# Altium project Photovoltaic Drive.PrjPcb (part 1 of 2)
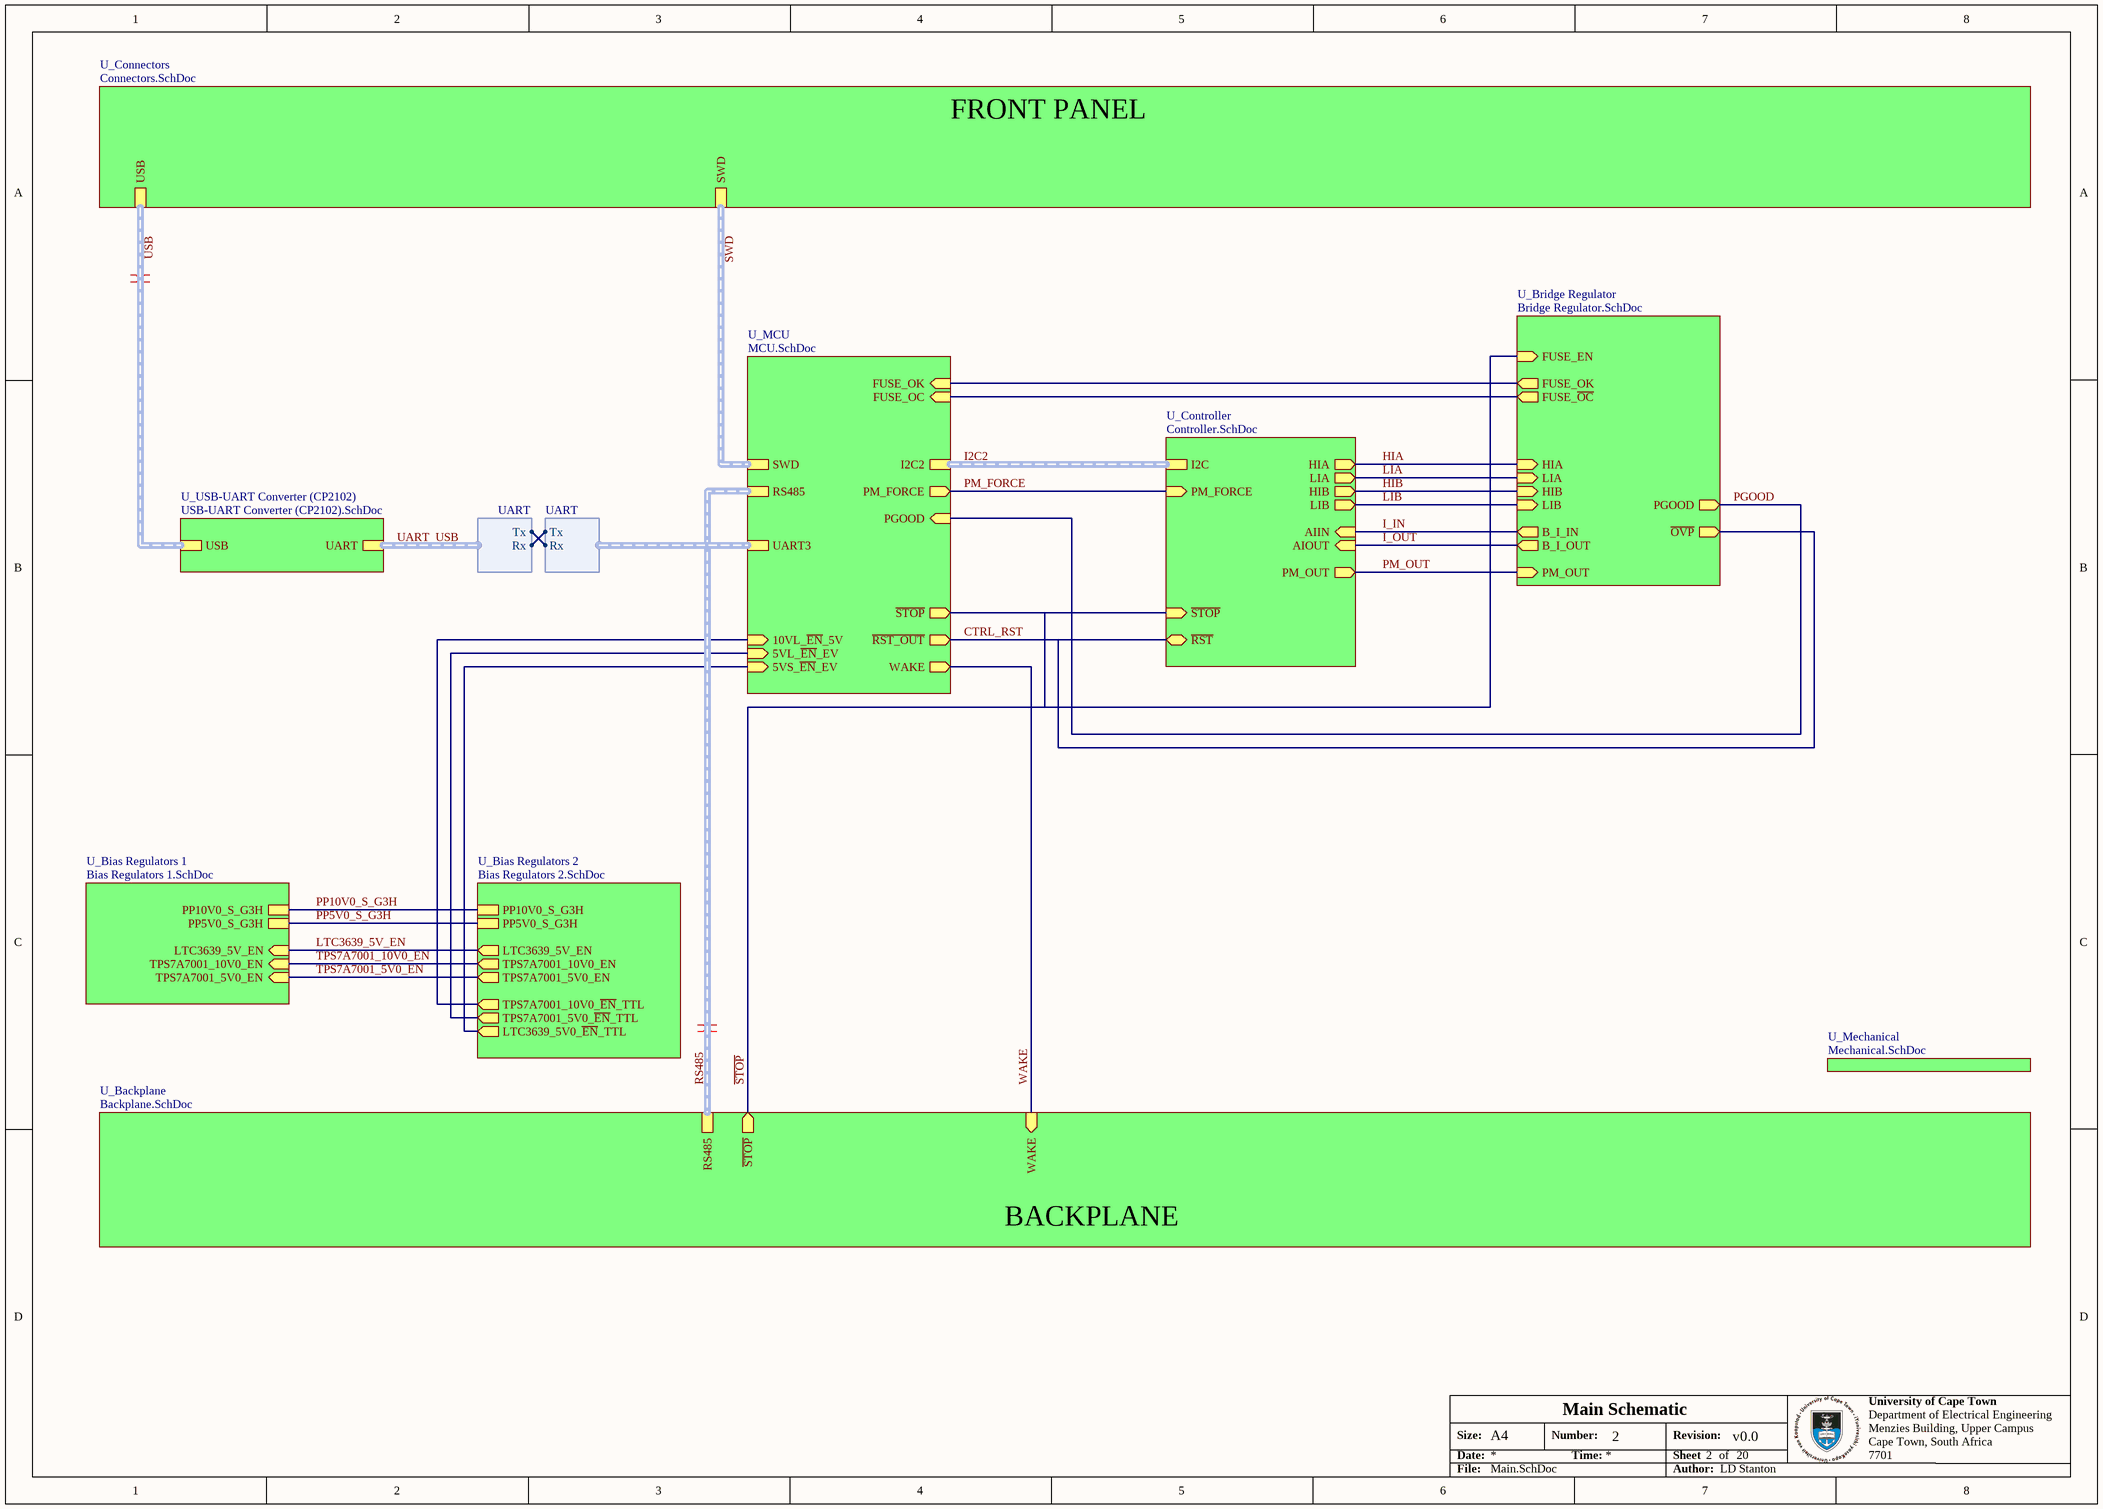
[diagram p0: Main.SchDoc]
Approv_Date_Chk: --/--/----; Approv_Date_Eng: --/--/----; ASM_DOC: Assembley.PCBDwf; BOM_DOC: Bill of Materials.csv; Checker: [UNCHECKED]; CPL_DOC: Pick & Place.csv; DwgTitleLine1: - - - - -; DwgTitleLine2: - - - - -; FAB_DOC: Fabrication.PCBDwf; PCB_DOC: PCB.PcbDoc; Project_Revision: v0.0; Rev_Date_1: --/--/----; Rev_Date_2: --/--/----; Rev_Date_3: --/--/----; Rev_Date_4: --/--/----; Rev_Desc_1: - - - - -; Rev_Desc_2: - - - - -; Rev_Desc_3: - - - - -; Rev_Desc_4: - - - - -; Rev_No_1: -; Rev_No_2: -; Rev_No_3: -; Rev_No_4: -; SCH_DOC: Main.SchDoc
5 sheets, 146 parts. Net scope: hierarchical (ports join the sheet entries above them; power ports are global).
Board file: PCB.PcbDoc
Sheets:
  Main.SchDoc
    U_Connectors = Connectors.SchDoc
    U_Controller = Controller.SchDoc
  System Regulators.SchDoc
  Bridge.SchDoc

## Sheet Main.SchDoc: Main Schematic
size A3; ApprovedBy: LD Stanton; CheckedBy: None; Author: LD Stanton; DrawnBy: LD Stanton; Engineer: LD Stanton; Organization: University of Cape Town; Address1: Department of Electrical Engineering; Address2: Menzies Building, Upper Campus; Address3: Cape Town, South Africa; Address4: 7701; DocumentNumber: 2; Revision: v1.0; SheetNumber: 2; SheetTotal: 20; Project_Name: Photovoltaic Controller

### Sub-sheets
U_Backplane = Backplane.SchDoc (file not in this document): RS485 (harness RS485), ~{STOP} (out), WAKE (in)
U_Bias Regulators 1 = Bias Regulators 1.SchDoc (file not in this document): PP10V0_S_G3H, TPS7A7001_5V0_EN (in), LTC3639_5V_EN (in), TPS7A7001_10V0_EN (in), PP5V0_S_G3H
U_Bias Regulators 2 = Bias Regulators 2.SchDoc (file not in this document): PP5V0_S_G3H, PP10V0_S_G3H, LTC3639_5V_EN (out), TPS7A7001_10V0_EN (out), TPS7A7001_5V0_EN (out), TPS7A7001_10V0_~{EN}_TTL (out), LTC3639_5V0_~{EN}_TTL (out), TPS7A7001_5V0_~{EN}_TTL (out)
U_Bridge Regulator = Bridge Regulator.SchDoc (file not in this document): LIA (in), HIA (in), HIB (in), LIB (in), B_I_IN (out), B_I_OUT (out), PGOOD (out), ~{OVP} (out), PM_OUT (in), FUSE_EN (in), FUSE_OK (out), FUSE_~{OC} (out)
U_Connectors = Connectors.SchDoc: USB (harness USB), SWD (harness SWD)
U_Controller = Controller.SchDoc: LIB (out), HIA (out), I2C (harness I2C), PM_OUT (out), AIIN (in), AIOUT (in), ~{RST} (bidir), HIB (out), LIA (out), PM_FORCE (in), ~{STOP} (in)
U_MCU = MCU.SchDoc (file not in this document): SWD (harness SWD), UART3 (harness UART), ~{RST_OUT} (out), PM_FORCE (out), WAKE (out), RS485 (harness RS485), I2C2 (harness I2C), FUSE_OK (in), ~{STOP} (out), FUSE_OC (in), PGOOD (in), 5VS_~{EN}_EV (in), 10VL_~{EN}_5V (in), 5VL_~{EN}_EV (in)
U_Mechanical = Mechanical.SchDoc (file not in this document): no entries
U_USB-UART Converter (CP2102) = USB-UART Converter (CP2102).SchDoc (file not in this document): USB (harness USB), UART (harness UART)

### Harnesses
UART: Rx, Tx

### Nets
~{STOP}: sheet U_MCU/~{STOP}, sheet U_Controller/~{STOP}, sheet U_Bridge Regulator/FUSE_EN, sheet U_Backplane/~{STOP}
CTRL_RST: sheet U_MCU/~{RST_OUT}, sheet U_Controller/~{RST}, sheet U_Bridge Regulator/~{OVP}  [project net ~{CTRL_RST}]
HIA: sheet U_Controller/HIA, sheet U_Bridge Regulator/HIA
HIB: sheet U_Controller/HIB, sheet U_Bridge Regulator/HIB
I_IN: sheet U_Controller/AIIN, sheet U_Bridge Regulator/B_I_IN
I_OUT: sheet U_Controller/AIOUT, sheet U_Bridge Regulator/B_I_OUT
LIA: sheet U_Controller/LIA, sheet U_Bridge Regulator/LIA
LIB: sheet U_Controller/LIB, sheet U_Bridge Regulator/LIB
LTC3639_5V_EN: sheet U_Bias Regulators 1/LTC3639_5V_EN, sheet U_Bias Regulators 2/LTC3639_5V_EN
PGOOD: sheet U_MCU/PGOOD, sheet U_Bridge Regulator/PGOOD
PM_FORCE: sheet U_MCU/PM_FORCE, sheet U_Controller/PM_FORCE
PM_OUT: sheet U_Controller/PM_OUT, sheet U_Bridge Regulator/PM_OUT
PP5V0_S_G3H: sheet U_Bias Regulators 1/PP5V0_S_G3H, sheet U_Bias Regulators 2/PP5V0_S_G3H
PP10V0_S_G3H: sheet U_Bias Regulators 1/PP10V0_S_G3H, sheet U_Bias Regulators 2/PP10V0_S_G3H
TPS7A7001_5V0_EN: sheet U_Bias Regulators 1/TPS7A7001_5V0_EN, sheet U_Bias Regulators 2/TPS7A7001_5V0_EN
TPS7A7001_10V0_EN: sheet U_Bias Regulators 1/TPS7A7001_10V0_EN, sheet U_Bias Regulators 2/TPS7A7001_10V0_EN
UART_USB.Rx: sheet U_USB-UART Converter (CP2102)/UART.Rx, sheet U_MCU/UART3.Tx
UART_USB.Tx: sheet U_USB-UART Converter (CP2102)/UART.Tx, sheet U_MCU/UART3.Rx
WAKE: sheet U_MCU/WAKE, sheet U_Backplane/WAKE
(unnamed): sheet U_MCU/FUSE_OK, sheet U_Bridge Regulator/FUSE_OK
(unnamed): sheet U_MCU/FUSE_OC, sheet U_Bridge Regulator/FUSE_~{OC}
(unnamed): sheet U_MCU/5VS_~{EN}_EV, sheet U_Bias Regulators 2/LTC3639_5V0_~{EN}_TTL
(unnamed): sheet U_MCU/10VL_~{EN}_5V, sheet U_Bias Regulators 2/TPS7A7001_10V0_~{EN}_TTL
(unnamed): sheet U_MCU/5VL_~{EN}_EV, sheet U_Bias Regulators 2/TPS7A7001_5V0_~{EN}_TTL

### Buses and harness runs
harness I2C2 = sheet U_Controller/I2C = sheet U_MCU/I2C2
harness RS485 = sheet U_Backplane/RS485 = sheet U_MCU/RS485
harness SWD = sheet U_Connectors/SWD = sheet U_MCU/SWD
harness UART_USB = sheet U_USB-UART Converter (CP2102)/UART
harness USB = sheet U_Connectors/USB = sheet U_USB-UART Converter (CP2102)/USB

### Layout directives
differential pair: (no net found under the mark)

### Notes on the sheet
- FRONT PANEL
- BACKPLANE
- Size:
- Date:
- A4
- Number:
- Time:
- Revision:
- Sheet
- of
- File:
- Author:

## Sheet Connectors.SchDoc: Connectors
size A4; ApprovedBy: LD Stanton; CheckedBy: None; Author: LD Stanton; CompanyName: University of Cape Town; DrawnBy: Lawrence Stanton; Engineer: Lawrence Stanton; Organization: University of Cape Town; Address1: Department of Electrical Engineering; Address2: Rondebosch; Address3: Cape Town; Address4: South Africa 7701; DocumentNumber: 3; SheetNumber: 3; SheetTotal: 20; Approv_Date_Eng: --/--/----; Approv_Date_Chk: --/--/----; PCB_Doc: TBD; ASM_Doc: TBD; FAB_Doc: TBD; CML_Doc: TBD; BOM_Doc: TBD
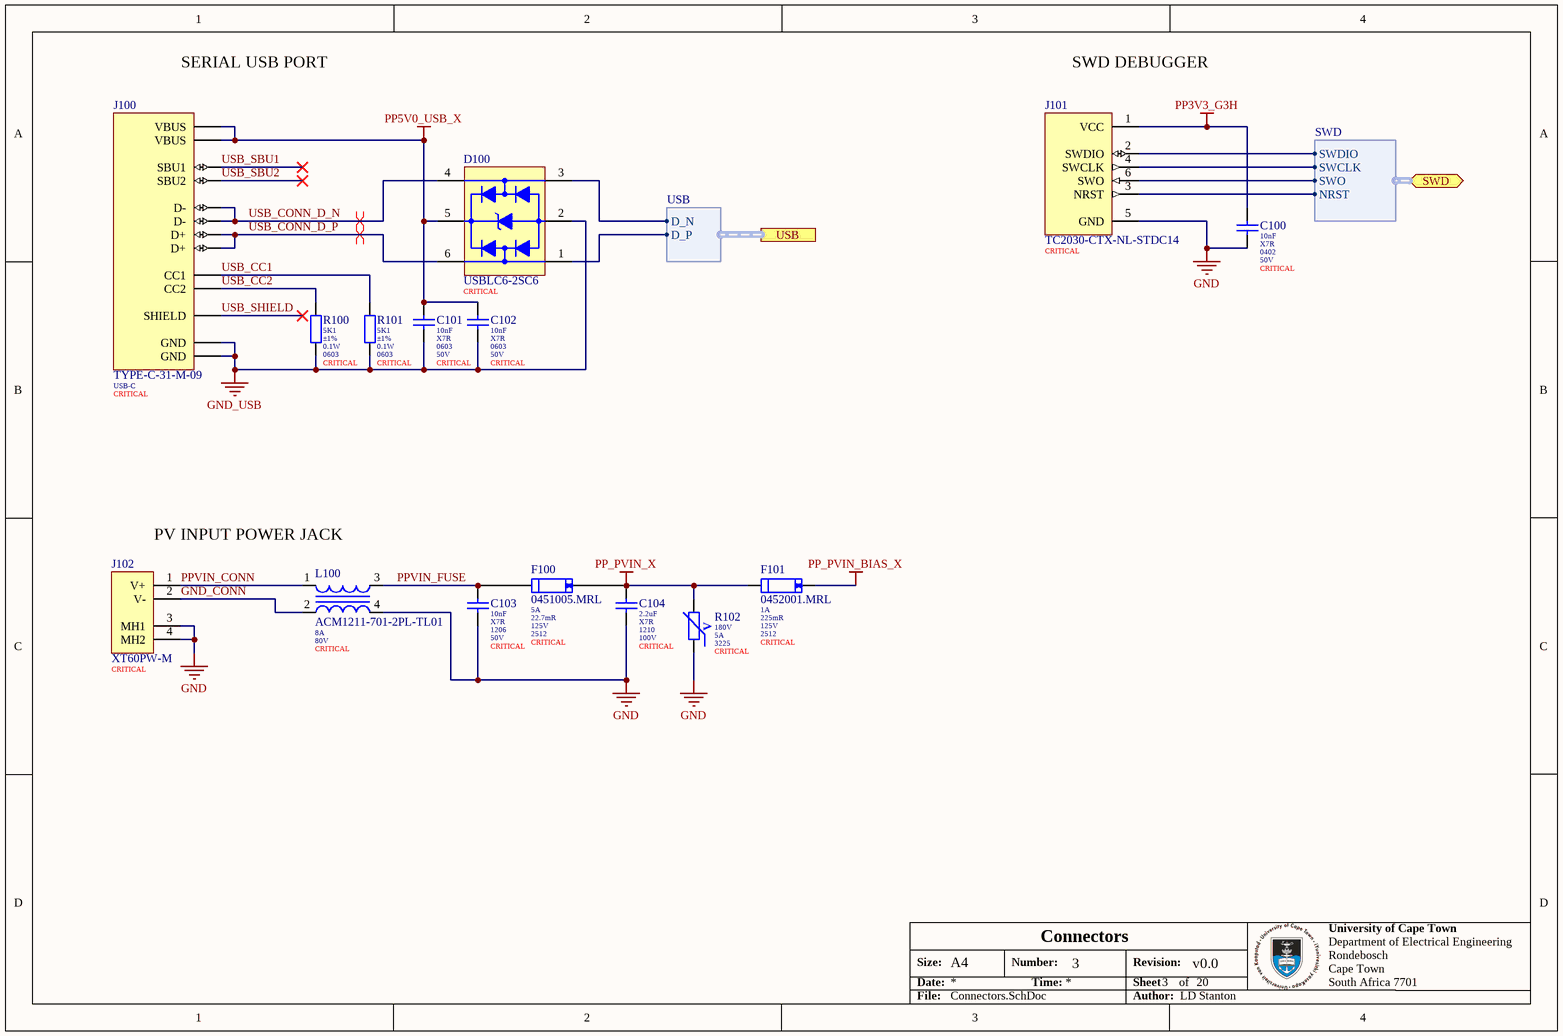
[diagram p1: Connectors.SchDoc]

### Parts
C100  value 10nF  Dielectric: X7R  Package: 0402  Voltage: 50V  Populate: CRITICAL  [0402_050_5 (Samsumg) B]  (hidden comment: CL05B103KB5NNNC)
C101  value 10nF  Dielectric: X7R  Package: 0603  Voltage: 50V  Populate: CRITICAL  [0603_080 (Guandong) B]  (hidden comment: 0603B103K500NT)
C102  value 10nF  Dielectric: X7R  Package: 0603  Voltage: 50V  Populate: CRITICAL  [0603_080 (Guandong) B]  (hidden comment: 0603B103K500NT)
C103  value 10nF  Dielectric: X7R  Package: 1206  Voltage: 50V  Populate: CRITICAL  [1206_125 (Guandong) B]  (hidden comment: 1206B103K500NT)
C104  value 2.2uF  Dielectric: X7R  Package: 1210  Voltage: 100V  Populate: CRITICAL  [1212_250_J (Samsumg) B]  (hidden comment: CL32B225KCJSNNE)
D100  USBLC6-2SC6  Placement: CRITICAL  [SOT-23-6 (USBLC6-2SC6 ST) B]
F100  0451005.MRL  Current: 5A  Resistance: 22.7mR  Voltage: 125V  Package: 2512  Placement: CRITICAL  [Littlefuse 45x B]
F101  0452001.MRL  Current: 1A  Resistance: 225mR  Voltage: 125V  Package: 2512  Placement: CRITICAL  [Littlefuse 45x B]
J100  TYPE-C-31-M-09  Type: USB-C  Placement: CRITICAL  [TYPE-C-31-M-09_OVH]
J101  TC2030-CTX-NL-STDC14  Placement: CRITICAL  [TC2030 NL]  (no BOM)
J102  XT60PW-M  Placement: CRITICAL  [XT60-PW_OVH]
L100  ACM1211-701-2PL-TL01  Current: 8A  Voltage: 80V  Placement: CRITICAL  [ACM1211]
R100  value 5K1  Tolerance: ±1%  Power: 0.1W  Package: 0603  Populate: CRITICAL  [0603 (Uniroyal) B]  (hidden comment: 0603WAF5101T5E)
R101  value 5K1  Tolerance: ±1%  Power: 0.1W  Package: 0603  Populate: CRITICAL  [0603 (Uniroyal) B]  (hidden comment: 0603WAF5101T5E)
R102  Varistor Voltage: 180V  Clamping Current: 5A  Package: 3225  Placement: CRITICAL  [3225 (B726) B]  (hidden comment: B72650M0111K072)

### Ports
SWD (bidir, harness SWD), USB (harness USB)

### Harnesses
USB: D_P, D_N
SWD: SWCLK, SWDIO, NRST, SWO

### Nets
GND: C100.2 C103.2 C104.2 J101.5(GND) J102.3(MH1) J102.4(MH2) L100.4 R102.1
GND_USB: C101.2 C102.2 D100.2(GND) J100.A1B12(GND) J100.B1A12(GND) R100.2 R101.2
PP3V3_G3H: C100.1 J101.1(VCC)
PP5V0_USB_X: C101.1 C102.1 D100.5(VBUS) J100.A4B9(VBUS) J100.B4A9(VBUS)
PP_PVIN_BIAS_X: F101.2
PP_PVIN_X: C104.1 F100.2 F101.1 R102.2
GND_CONN: J102.2(V-) L100.2
PPVIN_CONN: J102.1(V+) L100.1
PPVIN_FUSE: C103.1 F100.1 L100.3
SWD.NRST: J101.3(NRST) ; port SWD.NRST
SWD.SWCLK: J101.4(SWCLK) ; port SWD.SWCLK
SWD.SWDIO: J101.2(SWDIO) ; port SWD.SWDIO
SWD.SWO: J101.6(SWO) ; port SWD.SWO
USB.D_N: D100.3(I/O_2) ; port USB.D_N
USB.D_P: D100.1(I/O_1) ; port USB.D_P
USB_CC1: J100.A5(CC1) R101.1
USB_CC2: J100.B5(CC2) R100.1
USB_CONN_D_N: D100.4(I/O_3) J100.A7(D-) J100.B7(D-)
USB_CONN_D_P: D100.6(I/O_4) J100.A6(D+) J100.B6(D+)
USB_SBU1: J100.A8(SBU1)
USB_SBU2: J100.B8(SBU2)
USB_SHIELD: J100.1(SHIELD)

### Layout directives
differential pair: USB_CONN_D_N, USB_CONN_D_P

### Notes on the sheet
- SERIAL USB PORT
- SWD DEBUGGER
- PV INPUT POWER JACK
- Size:
- Date:
- A4
- Number:
- Time:
- Revision:
- Sheet
- of
- File:
- Author:
- (in symbol CMP-000045-3) V

### Library data of the parts
C100 = CMP-045-000005-9: MLCC 10nF 0402 50V X7R ±10%; Manufacturer: Samsung; ComponentLink1URL: https://datasheet.lcsc.com/szlcsc/Samsung-Electro-Mechanics-CL05C100JB5NNNC_C32949.pdf; Tolerance: ±10%; LCSC Part Number: C15195; ComponentLink1Description: Datasheet
C101 C102 = CMP-014-000000-11: MLCC 10nF 0603 50V X7R ±10%; Manufacturer: Guandong; Tolerance: ±15%; ComponentLink1Description: Datasheet; LCSC Part Number: C57112; ComponentLink1URL: https://datasheet.lcsc.com/szlcsc/Guangdong-Fenghua-Advanced-Tech-0402B102K500NT_C1523.pdf
C103 = CMP-014-000019-1: MLCC 10nF 1206 50V X7R ±10%; Manufacturer: Guandong; ComponentLink1URL: https://datasheet.lcsc.com/szlcsc/Guangdong-Fenghua-Advanced-Tech-0402B102K500NT_C1523.pdf; Tolerance: ±10%; LCSC Part Number: C1846; ComponentLink1Description: Datasheet
C104 = CMP-014-000010-1: MLCC 2.2uF 1210 100V X7R ±10%; Manufacturer: Samsung; LCSC Part Number: C55151; Tolerance: ±10%; ComponentLink1URL: https://datasheet.lcsc.com/szlcsc/Samsung-Electro-Mechanics-CL05C100JB5NNNC_C32949.pdf; ComponentLink1Description: Datasheet
D100 = CMP-004-00000-1: TVS Diode Array Low Capacitance SOT23-6; Manufacturer: Tech Public; Peak Pulse Current: 5A; Breakdown Voltage: 6V; Leakage Current: 150nA; Capacitance: 3.5pF; Data Rate: 480Mbps; Clamping Voltage: 17V; Max Operating Temperature: 125°C; Case/Package: SOT-23-6; ComponentLink1URL: https://datasheet.lcsc.com/lcsc/2108132230_TECH-PUBLIC-USBLC6-2SC6_C2827654.pdf; ComponentLink1Description: Datasheet; Min Operating Temperature: -40°C; RoHS Compliant: Yes; LCSC Part Number: C2827654
F100 = CMP-005-00002-1: Fuse 5A 125VAC/VDCSMD Littlefuse; Body Material: Ceramic; LCSC Part Number: C48467; Max Operating Temperature: 125°C; ComponentLink1Description: Datasheet; ComponentLink1URL: https://datasheet.lcsc.com/lcsc/1809291113_Littelfuse-0451010.MRL_C44479.pdf; Min Operating Temperature: -55°C; RoHS Compliant: Yes
F101 = CMP-005-00001-1: Fuse 1A 125VAC/VDC SMD Littlefuse; Body Material: Ceramic; RoHS Compliant: Yes; Max Operating Temperature: 125°C; Min Operating Temperature: -55°C; ComponentLink1URL: https://datasheet.lcsc.com/lcsc/1809191823_Littelfuse-0452001.MRL_C44669.pdf; LCSC Part Number: C44669; ComponentLink1Description: Datasheet
J100 = CMP-016-000003-6: USB Type C Jack USB2.0 SMD/TH; LCSC Part Number: C2689967; ComponentLink1URL: https://datasheet.lcsc.com/lcsc/2103221609_Korean-Hroparts-Elec-TYPE-C-31-M-09_C2689967.pdf; ComponentLink1Description: Drawing
J101 = CMP-000037-4: 6-Pin Plug-of-nails connector for SWD; ComponentLink1Description: Datasheet; ComponentLink1URL: https://www.tag-connect.com/wp-content/uploads/bsk-pdf-manager/TC2030-CTX_1.pdf
J102 = CMP-000030-3: DC Power Connector 500V 30A 0.50mR; DC Resistance: 0.5mR; Peak Current: 60A; LCSC Part Number: C98732; Insulation Rating: 500V; ComponentLink1URL: https://datasheet.lcsc.com/lcsc/1810251313_Changzhou-Amass-Elec-XT60PW-M_C98732.pdf; Rated Current: 30A; ComponentLink1Description: Datasheet
L100 = CMP-000044-4: Common Mode Choke 6mR 80V 8A 700R @ 100MHz; Min Operating Temperature: -40°C; Impedance: 700R; RoHS Compliant: Yes; Max Operating Temperature: 85°C; LCSC Part Number: C250214
R100 R101 = CMP-010-000393-1: Resistor 5K1 0603 ±1% Thick Film Uniroyal; Temperature Coefficient: ±100ppm/K; Working Voltage: 50V; LCSC Part Number: C23186; Pin Count: 2; Manufacturer: Uniroyal; Temperature: -55 - 155°C; ComponentLink1Description: Datasheet; ComponentLink1URL: https://datasheet.lcsc.com/szlcsc/1811062009_UNI-ROYAL-Uniroyal-Elec-0603WAF1002T5E_C25804.pdf
R102 = CMP-000045-3: Varistor MLV 115VAC/150VDC Rated 400A Peak 180V Trigger 3225; Capacitance: 110pF; Max Surge Current: 100A; Voltage Rating (AC): 115V; Voltage Rating (DC): 150V; Clamping Voltage: 36V; Min Operating Temperature: -40°C; Max Operating Temperature: 85°C; Max Voltage Rating (DC): 150V; RoHS Compliant: Yes; LCSC Part Number: C211089

## Sheet Controller.SchDoc: Controller
size A4; Project_Name: - - - - -; ApprovedBy: LD Stanton; CheckedBy: None; Author: LD Stanton; CompanyName: University of Cape Town; DrawnBy: Lawrence Stanton; Engineer: Lawrence Stanton; Organization: University of Cape Town; Address1: Department of Electrical Engineering; Address2: Rondebosch; Address3: Cape Town; Address4: South Africa 7701; DocumentNumber: 5; SheetNumber: 5; SheetTotal: 20; Approv_Date_Eng: --/--/----; Approv_Date_Chk: --/--/----; PCB_Doc: TBD; ASM_Doc: TBD; FAB_Doc: TBD; CML_Doc: TBD; BOM_Doc: TBD
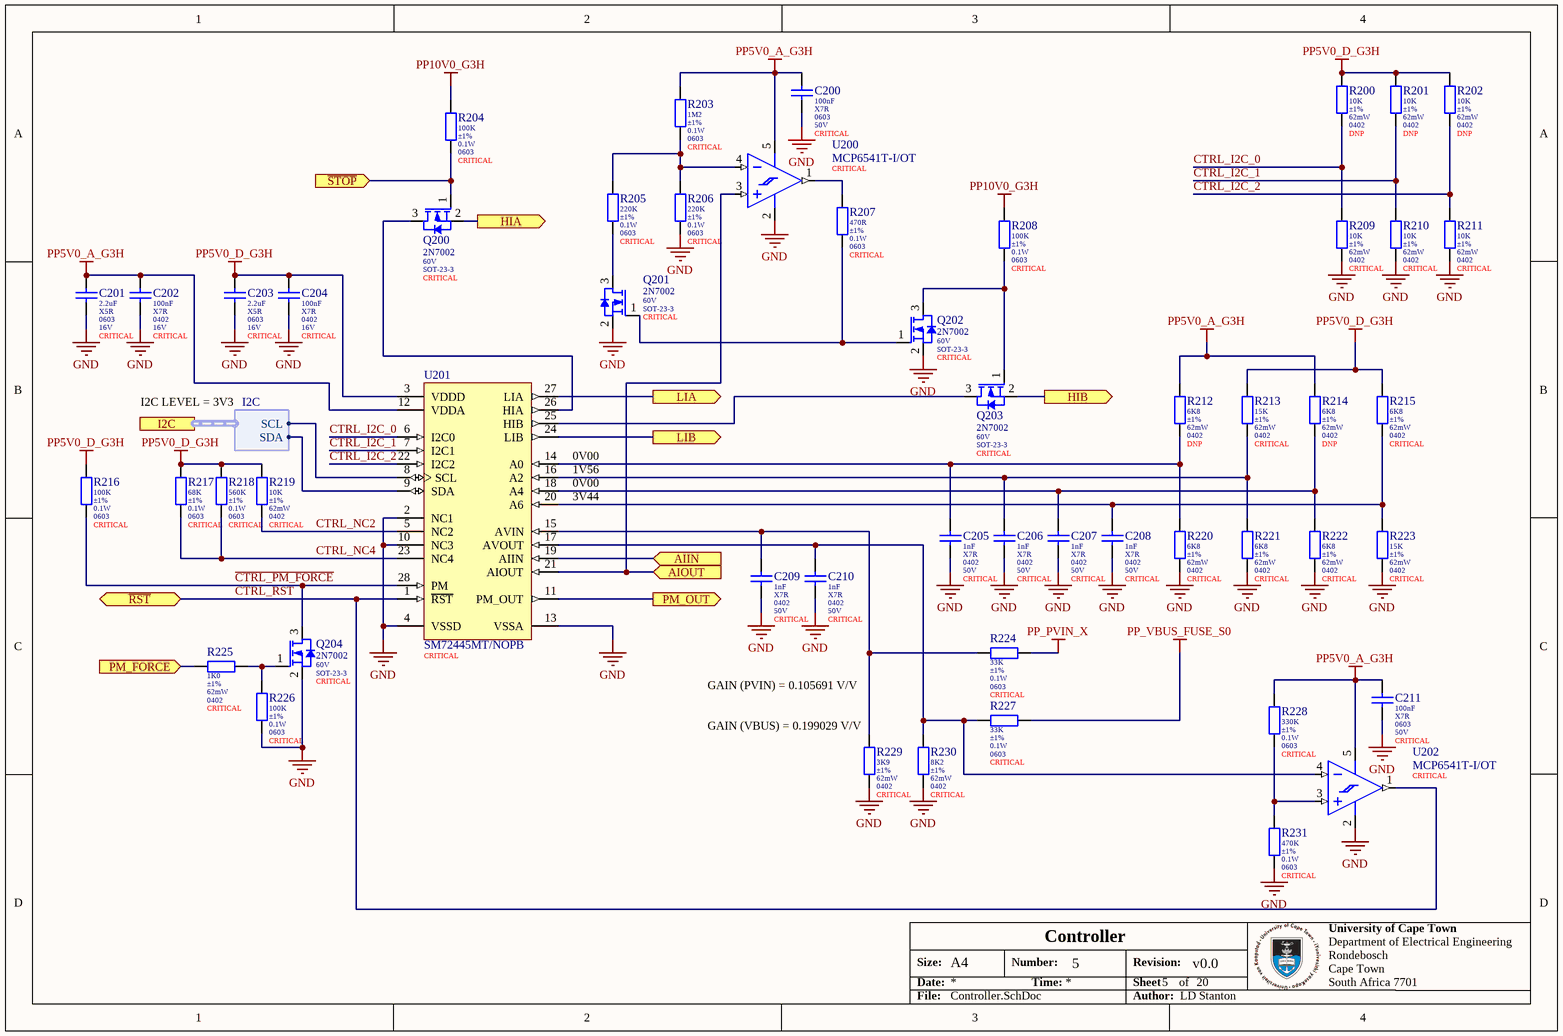
[diagram p2: Controller.SchDoc]

### Parts
C200  value 100nF  Dielectric: X7R  Package: 0603  Voltage: 50V  Populate: CRITICAL  [0603 (Yageo DA) B]  (hidden comment: CC0603KRX7R9BB104)
C201  value 2.2uF  Dielectric: X5R  Package: 0603  Voltage: 16V  Populate: CRITICAL  [0603_080_8 (Samsung) B]  (hidden comment: CL10A225KO8NNNC)
C202  value 100nF  Dielectric: X7R  Package: 0402  Voltage: 16V  Populate: CRITICAL  [0402_050_5 (Samsumg) B]  (hidden comment: CL05B104KO5NNNC)
C203  value 2.2uF  Dielectric: X5R  Package: 0603  Voltage: 16V  Populate: CRITICAL  [0603_080_8 (Samsung) B]  (hidden comment: CL10A225KO8NNNC)
C204  value 100nF  Dielectric: X7R  Package: 0402  Voltage: 16V  Populate: CRITICAL  [0402_050_5 (Samsumg) B]  (hidden comment: CL05B104KO5NNNC)
C205  value 1nF  Dielectric: X7R  Package: 0402  Voltage: 50V  Populate: CRITICAL  [0402_050 (Guandong) B]  (hidden comment: 0402B102K500NT)
C206  value 1nF  Dielectric: X7R  Package: 0402  Voltage: 50V  Populate: CRITICAL  [0402_050 (Guandong) B]  (hidden comment: 0402B102K500NT)
C207  value 1nF  Dielectric: X7R  Package: 0402  Voltage: 50V  Populate: CRITICAL  [0402_050 (Guandong) B]  (hidden comment: 0402B102K500NT)
C208  value 1nF  Dielectric: X7R  Package: 0402  Voltage: 50V  Populate: CRITICAL  [0402_050 (Guandong) B]  (hidden comment: 0402B102K500NT)
C209  value 1nF  Dielectric: X7R  Package: 0402  Voltage: 50V  Populate: CRITICAL  [0402_050 (Guandong) B]  (hidden comment: 0402B102K500NT)
C210  value 1nF  Dielectric: X7R  Package: 0402  Voltage: 50V  Populate: CRITICAL  [0402_050 (Guandong) B]  (hidden comment: 0402B102K500NT)
C211  value 100nF  Dielectric: X7R  Package: 0603  Voltage: 50V  Populate: CRITICAL  [0603 (Yageo DA) B]  (hidden comment: CC0603KRX7R9BB104)
Q200  2N7002  Maximum Drain Source Voltage: 60V  Package: SOT-23-3  Placement: CRITICAL  [SOT-23-3 (2N7002) B]
Q201  2N7002  Maximum Drain Source Voltage: 60V  Package: SOT-23-3  Placement: CRITICAL  [SOT-23-3 (2N7002) B]
Q202  2N7002  Maximum Drain Source Voltage: 60V  Package: SOT-23-3  Placement: CRITICAL  [SOT-23-3 (2N7002) B]
Q203  2N7002  Maximum Drain Source Voltage: 60V  Package: SOT-23-3  Placement: CRITICAL  [SOT-23-3 (2N7002) B]
Q204  2N7002  Maximum Drain Source Voltage: 60V  Package: SOT-23-3  Placement: CRITICAL  [SOT-23-3 (2N7002) B]
R200  value 10K  Tolerance: ±1%  Power: 62mW  Package: 0402  Populate: DNP  [0402 (Uniroyal) B]  (hidden comment: 0402WGF1002TCE)
R201  value 10K  Tolerance: ±1%  Power: 62mW  Package: 0402  Populate: DNP  [0402 (Uniroyal) B]  (hidden comment: 0402WGF1002TCE)
R202  value 10K  Tolerance: ±1%  Power: 62mW  Package: 0402  Populate: DNP  [0402 (Uniroyal) B]  (hidden comment: 0402WGF1002TCE)
R203  value 1M2  Tolerance: ±1%  Power: 0.1W  Package: 0603  Populate: CRITICAL  [0603 (Uniroyal) B]  (hidden comment: 0603WAF1204T5E)
R204  value 100K  Tolerance: ±1%  Power: 0.1W  Package: 0603  Populate: CRITICAL  [0603 (Uniroyal) B]  (hidden comment: 0603WAF1003T5E)
R205  value 220K  Tolerance: ±1%  Power: 0.1W  Package: 0603  Populate: CRITICAL  [0603 (Uniroyal) B]  (hidden comment: 0603WAF2203T5E)
R206  value 220K  Tolerance: ±1%  Power: 0.1W  Package: 0603  Populate: CRITICAL  [0603 (Uniroyal) B]  (hidden comment: 0603WAF2203T5E)
R207  value 470R  Tolerance: ±1%  Power: 0.1W  Package: 0603  Populate: CRITICAL  [0603 (Uniroyal) B]  (hidden comment: 0603WAF4700T5E)
R208  value 100K  Tolerance: ±1%  Power: 0.1W  Package: 0603  Populate: CRITICAL  [0603 (Uniroyal) B]  (hidden comment: 0603WAF1003T5E)
R209  value 10K  Tolerance: ±1%  Power: 62mW  Package: 0402  Populate: CRITICAL  [0402 (Uniroyal) B]  (hidden comment: 0402WGF1002TCE)
R210  value 10K  Tolerance: ±1%  Power: 62mW  Package: 0402  Populate: CRITICAL  [0402 (Uniroyal) B]  (hidden comment: 0402WGF1002TCE)
R211  value 10K  Tolerance: ±1%  Power: 62mW  Package: 0402  Populate: CRITICAL  [0402 (Uniroyal) B]  (hidden comment: 0402WGF1002TCE)
R212  value 6K8  Tolerance: ±1%  Power: 62mW  Package: 0402  Populate: DNP  [0402 (Uniroyal) B]  (hidden comment: 0402WGF6801TCE)
R213  value 15K  Tolerance: ±1%  Power: 62mW  Package: 0402  Populate: CRITICAL  [0402 (Uniroyal) B]  (hidden comment: 0402WGF1502TCE)
R214  value 6K8  Tolerance: ±1%  Power: 62mW  Package: 0402  Populate: DNP  [0402 (Uniroyal) B]  (hidden comment: 0402WGF6801TCE)
R215  value 6K8  Tolerance: ±1%  Power: 62mW  Package: 0402  Populate: CRITICAL  [0402 (Uniroyal) B]  (hidden comment: 0402WGF6801TCE)
R216  value 100K  Tolerance: ±1%  Power: 0.1W  Package: 0603  Populate: CRITICAL  [0603 (Uniroyal) B]  (hidden comment: 0603WAF1003T5E)
R217  value 68K  Tolerance: ±1%  Power: 0.1W  Package: 0603  Populate: CRITICAL  [0603 (Uniroyal) B]  (hidden comment: 0603WAF6802T5E)
R218  value 560K  Tolerance: ±1%  Power: 0.1W  Package: 0603  Populate: CRITICAL  [0603 (Uniroyal) B]  (hidden comment: 0603WAF5603T5E)
R219  value 10K  Tolerance: ±1%  Power: 62mW  Package: 0402  Populate: CRITICAL  [0402 (Uniroyal) B]  (hidden comment: 0402WGF1002TCE)
R220  value 6K8  Tolerance: ±1%  Power: 62mW  Package: 0402  Populate: CRITICAL  [0402 (Uniroyal) B]  (hidden comment: 0402WGF6801TCE)
R221  value 6K8  Tolerance: ±1%  Power: 62mW  Package: 0402  Populate: CRITICAL  [0402 (Uniroyal) B]  (hidden comment: 0402WGF6801TCE)
R222  value 6K8  Tolerance: ±1%  Power: 62mW  Package: 0402  Populate: CRITICAL  [0402 (Uniroyal) B]  (hidden comment: 0402WGF6801TCE)
R223  value 15K  Tolerance: ±1%  Power: 62mW  Package: 0402  Populate: CRITICAL  [0402 (Uniroyal) B]  (hidden comment: 0402WGF1502TCE)
R224  value 33K  Tolerance: ±1%  Power: 0.1W  Package: 0603  Populate: CRITICAL  [0603 (Uniroyal) B]  (hidden comment: 0603WAF3302T5E)
R225  value 1K0  Tolerance: ±1%  Power: 62mW  Package: 0402  Populate: CRITICAL  [0402 (Uniroyal) B]  (hidden comment: 0402WGF1001TCE)
R226  value 100K  Tolerance: ±1%  Power: 0.1W  Package: 0603  Populate: CRITICAL  [0603 (Uniroyal) B]  (hidden comment: 0603WAF1003T5E)
R227  value 33K  Tolerance: ±1%  Power: 0.1W  Package: 0603  Populate: CRITICAL  [0603 (Uniroyal) B]  (hidden comment: 0603WAF3302T5E)
R228  value 330K  Tolerance: ±1%  Power: 0.1W  Package: 0603  Populate: CRITICAL  [0603 (Uniroyal) B]  (hidden comment: 0603WAF3303T5E)
R229  value 3K9  Tolerance: ±1%  Power: 62mW  Package: 0402  Populate: CRITICAL  [0402 (Uniroyal) B]  (hidden comment: 0402WGF3901TCE)
R230  value 8K2  Tolerance: ±1%  Power: 62mW  Package: 0402  Populate: CRITICAL  [0402 (Uniroyal) B]  (hidden comment: 0402WGF8201TCE)
R231  value 470K  Tolerance: ±1%  Power: 0.1W  Package: 0603  Populate: CRITICAL  [0603 (Uniroyal) B]  (hidden comment: 0603WAF4703T5E)
U200  MCP6541T-I/OT  Placement: CRITICAL  [SOT-23-5 (MCP75x) B]
U201  SM72445MT/NOPB  Placement: CRITICAL  [PW0028A_N]
U202  MCP6541T-I/OT  Placement: CRITICAL  [SOT-23-5 (MCP75x) B]

### Ports
AIIN (in), AIOUT (in), HIA (out), HIB (out), I2C (harness I2C), LIA (out), LIB (out), PM_FORCE (in), PM_OUT (out), ~{RST} (bidir), ~{STOP} (in)

### Harnesses
I2C: SCL, SDA

### Nets
GND: C200.2 C201.2 C202.2 C203.2 C204.2 C205.2 C206.2 C207.2 C208.2 C209.2 C210.2 C211.2 Q201.2(S) Q202.2(S) Q204.2(S) R206.2 R209.2 R210.2 R211.2 R220.2 R221.2 R222.2 R223.2 R226.2 R229.2 R230.2 R231.2 U200.2(VSS) U201.2(NC1) U201.4(VSSD) U201.10(NC3) U201.13(VSSA) U202.2(VSS)
PP5V0_A_G3H: C200.1 C201.1 C202.1 C211.1 R203.1 R212.1 R214.1 R228.1 U200.5(VDD) U201.12(VDDA) U202.5(VDD)
PP5V0_D_G3H: C203.1 C204.1 R200.1 R201.1 R202.1 R213.1 R215.1 R216.1 R217.1 R218.1 R219.2 U201.3(VDDD)
PP10V0_G3H: R204.1 R208.1
PP_PVIN_X: R224.2
PP_VBUS_FUSE_S0: R227.2
~{CTRL_PM_FORCE}: Q204.3(D) R216.2 U201.28(PM)
~{CTRL_RST}: U201.1(~{RST}) U202.1(OUT) ; port ~{RST}
~{STOP}: Q200.1(G) R204.2 ; port ~{STOP}
CTRL_I2C_0: R200.2 R209.1 U201.6(I2C0)
CTRL_I2C_1: R201.2 R210.1 U201.7(I2C1)
CTRL_I2C_2: R202.2 R211.1 U201.22(I2C2)
CTRL_NC2: R219.1 U201.5(NC2)
CTRL_NC4: R217.2 R218.2 U201.23(NC4)
HIA: Q200.2(S) ; port HIA
HIB: Q203.2(S) ; port HIB
I2C2.SCL: U201.8(SCL) ; port I2C.SCL
I2C2.SDA: U201.9(SDA) ; port I2C.SDA
I_IN: U201.19(AIIN) ; port AIIN
I_OUT: U200.3(VIN+) U201.21(AIOUT) ; port AIOUT
LIA: U201.27(LIA) ; port LIA
LIB: U201.24(LIB) ; port LIB
PM_FORCE: R225.1 ; port PM_FORCE
PM_OUT: U201.11(PM_OUT) ; port PM_OUT
NetC205_1: C205.1 R212.2 R220.1 U201.14(A0)
NetC206_1: C206.1 R213.2 R221.1 U201.16(A2)
NetC207_1: C207.1 R214.2 R222.1 U201.18(A4)
NetC208_1: C208.1 R215.2 R223.1 U201.20(A6)
NetC209_1: C209.1 R224.1 R229.1 U201.15(AVIN)
NetC210_1: C210.1 R227.1 R230.1 U201.17(AVOUT) U202.4(VIN-)
NetQ200_3: Q200.3(D) U201.26(HIA)
NetQ201_1: Q201.1(G) Q202.1(G) R207.1
NetQ201_3: Q201.3(D) R205.2
NetQ202_3: Q202.3(D) Q203.1(G) R208.2
NetQ203_3: Q203.3(D) U201.25(HIB)
NetQ204_1: Q204.1(G) R225.2 R226.1
NetR203_2: R203.2 R205.1 R206.1 U200.4(VIN-)
NetR207_2: R207.2 U200.1(OUT)
NetR228_2: R228.2 R231.1 U202.3(VIN+)

### Notes on the sheet
- I2C LEVEL = 3V3
- (near U201) 1V56
- (near U201) 0V00
- (near U201) 3V44
- GAIN (PVIN) = 0.105691 V/V
- (near R229) GAIN (VBUS) = 0.199029 V/V
- Size:
- Date:
- A4
- Number:
- Time:
- Revision:
- Sheet
- of
- File:
- Author:

### Library data of the parts
C200 C211 = CMP-047-000000-7: MLCC 100nF 50V 0603 X7R ±10%; Manufacturer: Yageo; LCSC Part Number: C14663; Tolerance: ±10%; ComponentLink1URL: https://datasheet.lcsc.com/szlcsc/YAGEO-CC0603KRX7R9BB104_C14663.pdf; ComponentLink1Description: Datasheet
C201 C203 = CMP-045-000016-8: MLCC 2.2uF 0603 16V X5R ±10%; Manufacturer: Samsung; ComponentLink1URL: https://datasheet.lcsc.com/szlcsc/Samsung-Electro-Mechanics-CL05C100JB5NNNC_C32949.pdf; LCSC Part Number: C23630; Tolerance: ±10%; ComponentLink1Description: Datasheet
C202 C204 = CMP-045-000014-12: MLCC 100nF 0402 16V X7R ±10%; Manufacturer: Samsung; Tolerance: ±10%; ComponentLink1Description: Datasheet; ComponentLink1URL: https://datasheet.lcsc.com/szlcsc/Samsung-Electro-Mechanics-CL05C100JB5NNNC_C32949.pdf; LCSC Part Number: C1525
C205-C210 = CMP-014-000001-9: MLCC 1nF 0402 50V X7R ±10%; Manufacturer: Guandong; LCSC Part Number: C1523; ComponentLink1URL: https://datasheet.lcsc.com/szlcsc/Guangdong-Fenghua-Advanced-Tech-0402B102K500NT_C1523.pdf; ComponentLink1Description: Datasheet; Tolerance: ±10%
Q200-Q204 = CMP-040-000000-14: Small Signal MOSFET, 500 mA, 60 V, N-Channel, Enhancement, JCET SOT-23-3; Gate Threshold Voltage: 2V5; Power: 0.225W; Maximum Drain Current: 0.2A; Maximum Gate Source Voltage: ±20V; Drain-Source On Resistance: 7R; ComponentLink1Description: Datasheet; LCSC Part Number: C8545; ComponentLink1URL: https://datasheet.lcsc.com/szlcsc/Changjiang-Electronics-Tech-CJ-2N7002_C8545.pdf; Manufacturer: JCET
R200-R202 R209-R211 R219 = CMP-010-000292-12: Resistor 10K 0402 ±1% Thick Film Uniroyal; Working Voltage: 50V; Temperature Coefficient: ±100ppm/K; Manufacturer: Uniroyal; Pin Count: 2; ComponentLink1URL: https://datasheet.lcsc.com/szlcsc/1811062009_UNI-ROYAL-Uniroyal-Elec-0603WAF1002T5E_C25804.pdf; LCSC Part Number: C25744; Temperature: -55 - 155°C; ComponentLink1Description: Datasheet
R203 = CMP-010-000374-4: Resistor 1M2 0603 ±1% Thick Film Uniroyal; Temperature Coefficient: ±100ppm/K; Working Voltage: 75V; Temperature: -55 - 155°C; Pin Count: 2; ComponentLink1URL: https://datasheet.lcsc.com/szlcsc/1811062009_UNI-ROYAL-Uniroyal-Elec-0603WAF1002T5E_C25804.pdf; Manufacturer: Uniroyal; LCSC Part Number: C13315; ComponentLink1Description: Datasheet
R204 R208 R216 R226 = CMP-010-000288-10: Resistor 100K 0603 ±1% Thick Film Uniroyal; Working Voltage: 75V; Temperature Coefficient: ±100ppm/K; Manufacturer: Uniroyal; ComponentLink1URL: https://datasheet.lcsc.com/szlcsc/1811062009_UNI-ROYAL-Uniroyal-Elec-0603WAF1002T5E_C25804.pdf; LCSC Part Number: C25803; Temperature: -55 - 155°C; ComponentLink1Description: Datasheet; Pin Count: 2
R205 R206 = CMP-010-000401-2: Resistor 220K 0603 ±1% Thick Film Uniroyal; Temperature Coefficient: ±100ppm/K; Working Voltage: 75V; ComponentLink1URL: https://datasheet.lcsc.com/szlcsc/1811062009_UNI-ROYAL-Uniroyal-Elec-0603WAF1002T5E_C25804.pdf; Manufacturer: Uniroyal; LCSC Part Number: C22961; Temperature: -55 - 155°C; Pin Count: 2; ComponentLink1Description: Datasheet
R207 = CMP-010-000381-2: Resistor 470R 0603 ±5% Thick Film Uniroyal; Working Voltage: 75V; Temperature Coefficient: ±100ppm/K; ComponentLink1Description: Datasheet; Manufacturer: Uniroyal; Temperature: -55 - 155°C; LCSC Part Number: C23179; ComponentLink1URL: https://datasheet.lcsc.com/szlcsc/1811062009_UNI-ROYAL-Uniroyal-Elec-0603WAF1002T5E_C25804.pdf; Pin Count: 2
R212 R214 R215 R220-R222 = CMP-010-000385-1: Resistor 6K8 0402 ±1% Thick Film Uniroyal; Temperature Coefficient: ±100ppm/K; Working Voltage: 50V; Manufacturer: Uniroyal; LCSC Part Number: C25917; ComponentLink1Description: Datasheet; Temperature: -55 - 155°C; ComponentLink1URL: https://datasheet.lcsc.com/szlcsc/1811062009_UNI-ROYAL-Uniroyal-Elec-0603WAF1002T5E_C25804.pdf; Pin Count: 2
R213 R223 = CMP-010-000399-1: Resistor 15K 0402 ±1% Thick Film Uniroyal; Working Voltage: 50V; Temperature Coefficient: ±100ppm/K; ComponentLink1Description: Datasheet; Manufacturer: Uniroyal; Temperature: -55 - 155°C; LCSC Part Number: C25756; ComponentLink1URL: https://datasheet.lcsc.com/szlcsc/1811062009_UNI-ROYAL-Uniroyal-Elec-0603WAF1002T5E_C25804.pdf; Pin Count: 2
R217 = CMP-010-000350-9: Resistor 68K 0603 ±1% Thick Film Uniroyal; Working Voltage: 75V; Temperature Coefficient: ±100ppm/K; ComponentLink1Description: Datasheet; LCSC Part Number: C23231; ComponentLink1URL: https://datasheet.lcsc.com/szlcsc/1811062009_UNI-ROYAL-Uniroyal-Elec-0603WAF1002T5E_C25804.pdf; Temperature: -55 - 155°C; Pin Count: 2; Manufacturer: Uniroyal
R218 = CMP-010-000354-6: Resistor 560K 0603 ±1% Thick Film Uniroyal; Working Voltage: 75V; Temperature Coefficient: ±100ppm/K; Temperature: -55 - 155°C; Pin Count: 2; ComponentLink1URL: https://datasheet.lcsc.com/szlcsc/1811062009_UNI-ROYAL-Uniroyal-Elec-0603WAF1002T5E_C25804.pdf; ComponentLink1Description: Datasheet; LCSC Part Number: C23203; Manufacturer: Uniroyal
R224 R227 = CMP-010-000332-10: Resistor 33K 0603 ±1% Thick Film Uniroyal; Working Voltage: 75V; Temperature Coefficient: ±100ppm/K; Temperature: -55 - 155°C; ComponentLink1URL: https://datasheet.lcsc.com/szlcsc/1811062009_UNI-ROYAL-Uniroyal-Elec-0603WAF1002T5E_C25804.pdf; Manufacturer: Uniroyal; LCSC Part Number: C4216; ComponentLink1Description: Datasheet; Pin Count: 2
R225 = CMP-010-000307-13: Resistor 1K0 0402 ±1% Thick Film Uniroyal; Working Voltage: 50V; Temperature Coefficient: ±100ppm/K; Temperature: -55 - 155°C; ComponentLink1URL: https://datasheet.lcsc.com/szlcsc/1811062009_UNI-ROYAL-Uniroyal-Elec-0603WAF1002T5E_C25804.pdf; Manufacturer: Uniroyal; Pin Count: 2; ComponentLink1Description: Datasheet; LCSC Part Number: C11702
R228 = CMP-010-000382-2: Resistor 330K 0603 ±1% Thick Film Uniroyal; Temperature Coefficient: ±100ppm/K; Working Voltage: 75V; Pin Count: 2; Manufacturer: Uniroyal; ComponentLink1URL: https://datasheet.lcsc.com/szlcsc/1811062009_UNI-ROYAL-Uniroyal-Elec-0603WAF1002T5E_C25804.pdf; LCSC Part Number: C23137; Temperature: -55 - 155°C; ComponentLink1Description: Datasheet
R229 = CMP-010-000334-13: Resistor 3K9 0402 ±1% Thick Film Uniroyal; Working Voltage: 50V; Temperature Coefficient: ±100ppm/K; Manufacturer: Uniroyal; LCSC Part Number: C51721; Temperature: -55 - 155°C; ComponentLink1URL: https://datasheet.lcsc.com/szlcsc/1811062009_UNI-ROYAL-Uniroyal-Elec-0603WAF1002T5E_C25804.pdf; ComponentLink1Description: Datasheet; Pin Count: 2
R230 = CMP-010-000386-1: Resistor 8K2 0402 ±1% Thick Film Uniroyal; Working Voltage: 50V; Temperature Coefficient: ±100ppm/K; ComponentLink1Description: Datasheet; ComponentLink1URL: https://datasheet.lcsc.com/szlcsc/1811062009_UNI-ROYAL-Uniroyal-Elec-0603WAF1002T5E_C25804.pdf; LCSC Part Number: C25924; Manufacturer: Uniroyal; Temperature: -55 - 155°C; Pin Count: 2
R231 = CMP-010-000402-2: Resistor 470K 0603 ±1% Thick Film Uniroyal; Temperature Coefficient: ±100ppm/K; Working Voltage: 75V; ComponentLink1URL: https://datasheet.lcsc.com/szlcsc/1811062009_UNI-ROYAL-Uniroyal-Elec-0603WAF1002T5E_C25804.pdf; Pin Count: 2; Temperature: -55 - 155°C; LCSC Part Number: C23178; ComponentLink1Description: Datasheet; Manufacturer: Uniroyal
U200 U202 = CMP-000025-4: Comparator, Push-Pull, 1V6-5V5, 600nA,  SOT-23-5; Min Supply Voltage: 1.6V; Max Supply Voltage: 5.5V; Propagation Delay: 8us; Quiescent Current: 1uA; Nominal Supply Current: 1mA; Input Bias Current: 1pA; Input Offset Voltage (Vos): 7mV; Hysteresis: 6.5mV; Output Current: 2mA; Package: SOT-23-5; ComponentLink1Description: Datasheet; Output Type: Push-Pull; Min Operating Temperature: -40°C; RoHS: Yes; Max Operating Temperature: 85°C; ComponentLink1URL: https://ww1.microchip.com/downloads/en/DeviceDoc/MCP6541%20Output%20SubMicroamp%20Comparators%2020001696K.pdf; LCSC Part Number: C80839
U201 = CMP-019-00000-4: Texas Instruments MPPT Photovoltaic Cell Controller, 220kHz, TSSOP-28; Min Input Voltage: 4.75V; Input Current: 10nA; Max Supply Voltage: 5.25V; Supply Current: 11.5mA; RoHS: Yes; Max Operating Temperature: 105°C; Min Operating Temperature: -40°C; Height: 0.9mm; ComponentLink1URL: https://www.ti.com/lit/ds/symlink/sm72442.pdf?ts=1624215339045&ref_url=https%253A%252F%252Fwww.ti.com%252Fproduct%252FSM72442; ComponentLink1Description: Datasheet; Max Input Voltage: 5.25V; Case/Package: TSSOP; Min Supply Voltage: 4.75V

## Sheet System Regulators.SchDoc: System Bias Regulators
size A4; ApprovedBy: LD Stanton; CheckedBy: None; Author: LD Stanton; CompanyName: University of Cape Town; DrawnBy: Lawrence Stanton; Engineer: Lawrence Stanton; Organization: University of Cape Town; Address1: Department of Electrical Engineering; Address2: Rondebosch; Address3: Cape Town; Address4: South Africa 7701; DocumentNumber: 1; SheetNumber: 1; SheetTotal: 1; Approv_Date_Eng: --/--/----; Approv_Date_Chk: --/--/----; PCB_Doc: TBD; ASM_Doc: TBD; FAB_Doc: TBD; CML_Doc: TBD; BOM_Doc: TBD
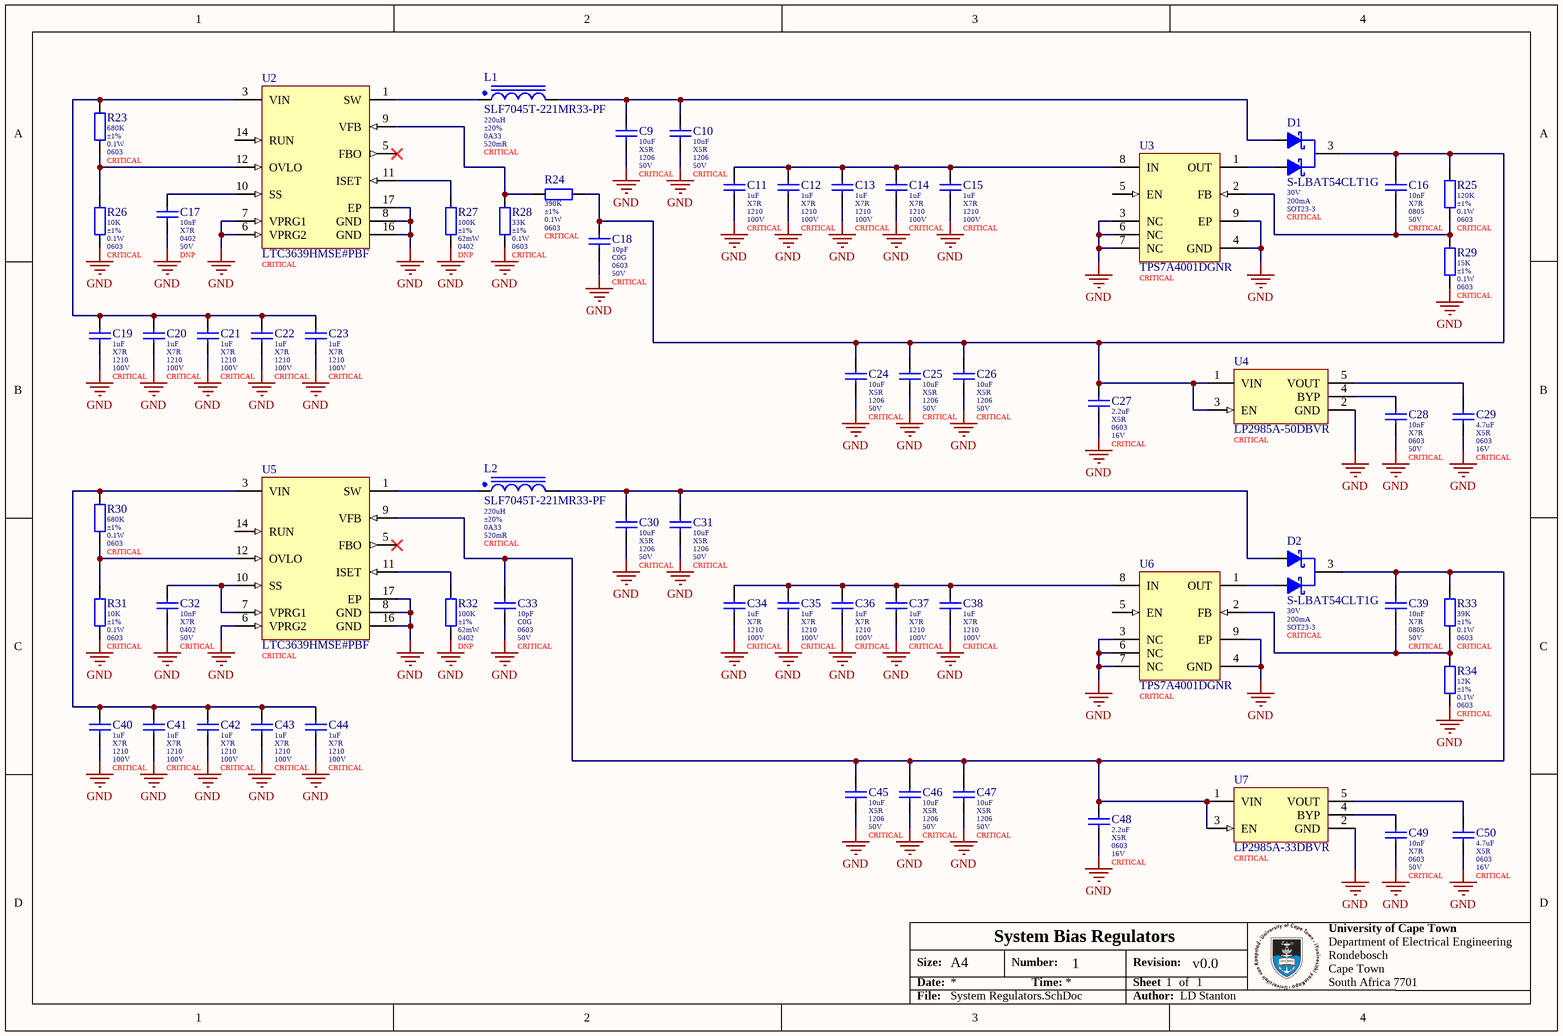
[diagram p3: System Regulators.SchDoc]

### Parts
C9  value 10uF  Dielectric: X5R  Package: 1206  Voltage: 50V  Populate: CRITICAL  [1206_160_H_N]  (hidden comment: CL31A106KBHNNNE)
C10  value 10uF  Dielectric: X5R  Package: 1206  Voltage: 50V  Populate: CRITICAL  [1206_160_H_N]  (hidden comment: CL31A106KBHNNNE)
C11  value 1uF  Dielectric: X7R  Package: 1210  Voltage: 100V  Populate: CRITICAL  [1210_250_J_N]  (hidden comment: CL32B105KCJNNNE)
C12  value 1uF  Dielectric: X7R  Package: 1210  Voltage: 100V  Populate: CRITICAL  [1210_250_J_N]  (hidden comment: CL32B105KCJNNNE)
C13  value 1uF  Dielectric: X7R  Package: 1210  Voltage: 100V  Populate: CRITICAL  [1210_250_J_N]  (hidden comment: CL32B105KCJNNNE)
C14  value 1uF  Dielectric: X7R  Package: 1210  Voltage: 100V  Populate: CRITICAL  [1210_250_J_N]  (hidden comment: CL32B105KCJNNNE)
C15  value 1uF  Dielectric: X7R  Package: 1210  Voltage: 100V  Populate: CRITICAL  [1210_250_J_N]  (hidden comment: CL32B105KCJNNNE)
C16  value 10nF  Dielectric: X7R  Package: 0805  Voltage: 50V  Populate: CRITICAL  [0605_065_A_N]  (hidden comment: CL21B103KBANNNC)
C17  value 10nF  Dielectric: X7R  Package: 0402  Voltage: 50V  Populate: DNP  [0402_050_5_N]  (hidden comment: CL05B103KB5NNNC)
C18  value 10pF  Dielectric: C0G  Package: 0603  Voltage: 50V  Populate: CRITICAL  [0603_080_8_N]  (hidden comment: CL10C100JB8NNNC)
C19  value 1uF  Dielectric: X7R  Package: 1210  Voltage: 100V  Populate: CRITICAL  [1210_250_J_N]  (hidden comment: CL32B105KCJNNNE)
C20  value 1uF  Dielectric: X7R  Package: 1210  Voltage: 100V  Populate: CRITICAL  [1210_250_J_N]  (hidden comment: CL32B105KCJNNNE)
C21  value 1uF  Dielectric: X7R  Package: 1210  Voltage: 100V  Populate: CRITICAL  [1210_250_J_N]  (hidden comment: CL32B105KCJNNNE)
C22  value 1uF  Dielectric: X7R  Package: 1210  Voltage: 100V  Populate: CRITICAL  [1210_250_J_N]  (hidden comment: CL32B105KCJNNNE)
C23  value 1uF  Dielectric: X7R  Package: 1210  Voltage: 100V  Populate: CRITICAL  [1210_250_J_N]  (hidden comment: CL32B105KCJNNNE)
C24  value 10uF  Dielectric: X5R  Package: 1206  Voltage: 50V  Populate: CRITICAL  [1206_160_H_N]  (hidden comment: CL31A106KBHNNNE)
C25  value 10uF  Dielectric: X5R  Package: 1206  Voltage: 50V  Populate: CRITICAL  [1206_160_H_N]  (hidden comment: CL31A106KBHNNNE)
C26  value 10uF  Dielectric: X5R  Package: 1206  Voltage: 50V  Populate: CRITICAL  [1206_160_H_N]  (hidden comment: CL31A106KBHNNNE)
C27  value 2.2uF  Dielectric: X5R  Package: 0603  Voltage: 16V  Populate: CRITICAL  [0603_080_8_N]  (hidden comment: CL10A225KO8NNNC)
C28  value 10nF  Dielectric: X7R  Package: 0603  Voltage: 50V  Populate: CRITICAL  [0603_080]  (hidden comment: 0603B103K500NT)
C29  value 4.7uF  Dielectric: X5R  Package: 0603  Voltage: 16V  Populate: CRITICAL  [0603_080_8_N]  (hidden comment: CL10A475KO8NNNC)
C30  value 10uF  Dielectric: X5R  Package: 1206  Voltage: 50V  Populate: CRITICAL  [1206_160_H_N]  (hidden comment: CL31A106KBHNNNE)
C31  value 10uF  Dielectric: X5R  Package: 1206  Voltage: 50V  Populate: CRITICAL  [1206_160_H_N]  (hidden comment: CL31A106KBHNNNE)
C32  value 10nF  Dielectric: X7R  Package: 0402  Voltage: 50V  Populate: CRITICAL  [0402_050_5_N]  (hidden comment: CL05B103KB5NNNC)
C33  value 10pF  Dielectric: C0G  Package: 0603  Voltage: 50V  Populate: CRITICAL  [0603_080_8_N]  (hidden comment: CL10C100JB8NNNC)
C34  value 1uF  Dielectric: X7R  Package: 1210  Voltage: 100V  Populate: CRITICAL  [1210_250_J_N]  (hidden comment: CL32B105KCJNNNE)
C35  value 1uF  Dielectric: X7R  Package: 1210  Voltage: 100V  Populate: CRITICAL  [1210_250_J_N]  (hidden comment: CL32B105KCJNNNE)
C36  value 1uF  Dielectric: X7R  Package: 1210  Voltage: 100V  Populate: CRITICAL  [1210_250_J_N]  (hidden comment: CL32B105KCJNNNE)
C37  value 1uF  Dielectric: X7R  Package: 1210  Voltage: 100V  Populate: CRITICAL  [1210_250_J_N]  (hidden comment: CL32B105KCJNNNE)
C38  value 1uF  Dielectric: X7R  Package: 1210  Voltage: 100V  Populate: CRITICAL  [1210_250_J_N]  (hidden comment: CL32B105KCJNNNE)
C39  value 10nF  Dielectric: X7R  Package: 0805  Voltage: 50V  Populate: CRITICAL  [0605_065_A_N]  (hidden comment: CL21B103KBANNNC)
C40  value 1uF  Dielectric: X7R  Package: 1210  Voltage: 100V  Populate: CRITICAL  [1210_250_J_N]  (hidden comment: CL32B105KCJNNNE)
C41  value 1uF  Dielectric: X7R  Package: 1210  Voltage: 100V  Populate: CRITICAL  [1210_250_J_N]  (hidden comment: CL32B105KCJNNNE)
C42  value 1uF  Dielectric: X7R  Package: 1210  Voltage: 100V  Populate: CRITICAL  [1210_250_J_N]  (hidden comment: CL32B105KCJNNNE)
C43  value 1uF  Dielectric: X7R  Package: 1210  Voltage: 100V  Populate: CRITICAL  [1210_250_J_N]  (hidden comment: CL32B105KCJNNNE)
C44  value 1uF  Dielectric: X7R  Package: 1210  Voltage: 100V  Populate: CRITICAL  [1210_250_J_N]  (hidden comment: CL32B105KCJNNNE)
C45  value 10uF  Dielectric: X5R  Package: 1206  Voltage: 50V  Populate: CRITICAL  [1206_160_H_N]  (hidden comment: CL31A106KBHNNNE)
C46  value 10uF  Dielectric: X5R  Package: 1206  Voltage: 50V  Populate: CRITICAL  [1206_160_H_N]  (hidden comment: CL31A106KBHNNNE)
C47  value 10uF  Dielectric: X5R  Package: 1206  Voltage: 50V  Populate: CRITICAL  [1206_160_H_N]  (hidden comment: CL31A106KBHNNNE)
C48  value 2.2uF  Dielectric: X5R  Package: 0603  Voltage: 16V  Populate: CRITICAL  [0603_080_8_N]  (hidden comment: CL10A225KO8NNNC)
C49  value 10nF  Dielectric: X7R  Package: 0603  Voltage: 50V  Populate: CRITICAL  [0603_080]  (hidden comment: 0603B103K500NT)
C50  value 4.7uF  Dielectric: X5R  Package: 0603  Voltage: 16V  Populate: CRITICAL  [0603_080_8_N]  (hidden comment: CL10A475KO8NNNC)
D1  S-LBAT54CLT1G  Reverse Voltage: 30V  Forward Current: 200mA  Package: SOT23-3  Placement: CRITICAL  [SOT-23-3 (LBAT54C) B]
D2  S-LBAT54CLT1G  Reverse Voltage: 30V  Forward Current: 200mA  Package: SOT23-3  Placement: CRITICAL  [SOT-23-3 (LBAT54C) B]
L1  SLF7045T-221MR33-PF  value 220uH  Tolerance: ±20%  Rated Current: 0A33  DC Resistance: 520mR  Populate: CRITICAL  [SLF7045 B]
L2  SLF7045T-221MR33-PF  value 220uH  Tolerance: ±20%  Rated Current: 0A33  DC Resistance: 520mR  Populate: CRITICAL  [SLF7045 B]
R23  value 680K  Tolerance: ±1%  Power: 0.1W  Populate: CRITICAL  [0603]  (hidden comment: 0603WAF6803T5E)
R24  value 390K  Tolerance: ±1%  Power: 0.1W  Populate: CRITICAL  [0603]  (hidden comment: 0603WAF3903T5E)
R25  value 120K  Tolerance: ±1%  Power: 0.1W  Populate: CRITICAL  [0603]  (hidden comment: 0603WAF1203T5E)
R26  value 10K  Tolerance: ±1%  Power: 0.1W  Populate: CRITICAL  [0603]  (hidden comment: 0603WAF1002T5E)
R27  value 100K  Tolerance: ±1%  Power: 62mW  Populate: DNP  [0402]  (hidden comment: 0402WGF1003TCE)
R28  value 33K  Tolerance: ±1%  Power: 0.1W  Populate: CRITICAL  [0603]  (hidden comment: 0603WAF3302T5E)
R29  value 15K  Tolerance: ±1%  Power: 0.1W  Populate: CRITICAL  [0603]  (hidden comment: 0603WAF1502T5E)
R30  value 680K  Tolerance: ±1%  Power: 0.1W  Populate: CRITICAL  [0603]  (hidden comment: 0603WAF6803T5E)
R31  value 10K  Tolerance: ±1%  Power: 0.1W  Populate: CRITICAL  [0603]  (hidden comment: 0603WAF1002T5E)
R32  value 100K  Tolerance: ±1%  Power: 62mW  Populate: DNP  [0402]  (hidden comment: 0402WGF1003TCE)
R33  value 39K  Tolerance: ±1%  Power: 0.1W  Populate: CRITICAL  [0603]  (hidden comment: 0603WAF3902T5E)
R34  value 12K  Tolerance: ±1%  Power: 0.1W  Populate: CRITICAL  [0603]  (hidden comment: 0603WAF1202T5E)
U2  LTC3639HMSE#PBF  Placement: CRITICAL  [LT-MSE-16-V(12)4PR-EDP_N]
U3  TPS7A4001DGNR  Placement: CRITICAL  [DGN0008B_N]
U4  LP2985A-50DBVR  Placement: CRITICAL  [SOT-23-5 (DBV0005A) B]
U5  LTC3639HMSE#PBF  Placement: CRITICAL  [LT-MSE-16-V(12)4PR-EDP_N]
U6  TPS7A4001DGNR  Placement: CRITICAL  [DGN0008B_N]
U7  LP2985A-33DBVR  Placement: CRITICAL  [SOT-23-5 (DBV0005A) B]

### Nets
GND: C9.2 C10.2 C11.2 C12.2 C13.2 C14.2 C15.2 C17.2 C18.2 C19.2 C20.2 C21.2 C22.2 C23.2 C24.2 C25.2 C26.2 C27.2 C28.2 C29.2 C30.2 C31.2 C32.2 C33.2 C34.2 C35.2 C36.2 C37.2 C38.2 C40.2 C41.2 C42.2 C43.2 C44.2 C45.2 C46.2 C47.2 C48.2 C49.2 C50.2 R26.2 R27.2 R28.2 R29.2 R31.2 R32.2 R34.2 U2.6(VPRG2) U2.7(VPRG1) U2.8(GND) U2.16(GND) U2.17(EP) U3.3(NC) U3.4(GND) U3.6(NC) U3.7(NC) U3.9(EP) U4.2(GND) U5.6(VPRG2) U5.8(GND) U5.16(GND) U5.17(EP) U6.3(NC) U6.4(GND) U6.6(NC) U6.7(NC) U6.9(EP) U7.2(GND)
NetC9_1: C9.1 C10.1 D1.1(A1) L1.2
NetC11_1: C11.1 C12.1 C13.1 C14.1 C15.1 U3.8(IN)
NetC16_1: C16.1 C18.1 C24.1 C25.1 C26.1 C27.1 D1.3(K) R24.1 R25.1 U4.1(VIN) U4.3(EN)
NetC16_2: C16.2 R25.2 R29.1 U3.2(FB)
NetC17_1: C17.1 U2.10(SS)
NetC19_1: C19.1 C20.1 C21.1 C22.1 C23.1 R23.1 U2.3(VIN)
NetC28_1: C28.1 U4.4(BYP)
NetC29_1: C29.1 U4.5(VOUT)
NetC30_1: C30.1 C31.1 D2.1(A1) L2.2
NetC32_1: C32.1 U5.7(VPRG1) U5.10(SS)
NetC33_1: C33.1 C39.1 C45.1 C46.1 C47.1 C48.1 D2.3(K) R33.1 U5.9(VFB) U7.1(VIN) U7.3(EN)
NetC34_1: C34.1 C35.1 C36.1 C37.1 C38.1 U6.8(IN)
NetC39_2: C39.2 R33.2 R34.1 U6.2(FB)
NetC40_1: C40.1 C41.1 C42.1 C43.1 C44.1 R30.1 U5.3(VIN)
NetC49_1: C49.1 U7.4(BYP)
NetC50_1: C50.1 U7.5(VOUT)
NetD1_2: D1.2(A2) U3.1(OUT)
NetD2_2: D2.2(A2) U6.1(OUT)
NetL1_1: L1.1 U2.1(SW)
NetL2_1: L2.1 U5.1(SW)
NetR23_2: R23.2 R26.1 U2.12(OVLO)
NetR24_2: R24.2 R28.1 U2.9(VFB)
NetR27_1: R27.1 U2.11(ISET)
NetR30_2: R30.2 R31.1 U5.12(OVLO)
NetR32_1: R32.1 U5.11(ISET)

Not connected (* = marked no-connect by the designer): U2 5(FBO)* 14(RUN); U3 5(EN); U5 5(FBO)* 14(RUN); U6 5(EN)

### Notes on the sheet
- Size:
- Date:
- A4
- Number:
- Time:
- Revision:
- Sheet
- of
- File:
- Author:

### Library data of the parts
C9 C10 C24-C26 C30 C31 C45-C47 = CMP-045-000010-6: MLCC 10uF 1206 50V X5R ±10%; Manufacturer: Samsung; ComponentLink1Description: Datasheet; ComponentLink1URL: https://datasheet.lcsc.com/szlcsc/Samsung-Electro-Mechanics-CL05C100JB5NNNC_C32949.pdf; LCSC Part Number: C13585; Tolerance: ±10%
C11-C15 C19-C23 C34-C38 C40-C44 = CMP-014-000009-1: MLCC 1uF 1210 100V X7R ±10%; Manufacturer: Samsung; ComponentLink1URL: https://datasheet.lcsc.com/szlcsc/Samsung-Electro-Mechanics-CL05C100JB5NNNC_C32949.pdf; LCSC Part Number: C444847; ComponentLink1Description: Datasheet; Tolerance: ±10%
C16 C39 = CMP-045-000006-7: MLCC 10nF 0805 50V X7R ±10%; Manufacturer: Samsung; LCSC Part Number: C1710; Tolerance: ±10%; ComponentLink1URL: https://datasheet.lcsc.com/szlcsc/Samsung-Electro-Mechanics-CL05C100JB5NNNC_C32949.pdf; ComponentLink1Description: Datasheet
C17 C32 = CMP-045-000005-8: MLCC 10nF 0402 50V X7R ±10%; Manufacturer: Samsung; ComponentLink1Description: Datasheet; ComponentLink1URL: https://datasheet.lcsc.com/szlcsc/Samsung-Electro-Mechanics-CL05C100JB5NNNC_C32949.pdf; Tolerance: ±10%; LCSC Part Number: C15195
C18 C33 = CMP-045-000007-6: MLCC 10pF 0603 C0G ±0.1pF; Manufacturer: Samsung; LCSC Part Number: C1634; ComponentLink1URL: https://datasheet.lcsc.com/szlcsc/Samsung-Electro-Mechanics-CL05C100JB5NNNC_C32949.pdf; Tolerance: ±0.1pF; ComponentLink1Description: Datasheet
C27 C48 = CMP-045-000016-6: MLCC 2.2uF 0603 16V X5R ±10%; Manufacturer: Samsung; Tolerance: ±10%; LCSC Part Number: C23630; ComponentLink1URL: https://datasheet.lcsc.com/szlcsc/Samsung-Electro-Mechanics-CL05C100JB5NNNC_C32949.pdf; ComponentLink1Description: Datasheet
C28 C49 = CMP-014-000000-7: MLCC 10nF 0603 50V X7R ±10%; Manufacturer: Guandong; Tolerance: ±15%; LCSC Part Number: C57112; ComponentLink1URL: https://datasheet.lcsc.com/szlcsc/Guangdong-Fenghua-Advanced-Tech-0402B102K500NT_C1523.pdf; ComponentLink1Description: Datasheet
C29 C50 = CMP-014-000007-3: MLCC 4.7uF 0603 16V X5R ±10%; Manufacturer: Samsung; LCSC Part Number: C19666; Tolerance: ±10%; ComponentLink1Description: Datasheet; ComponentLink1URL: https://datasheet.lcsc.com/szlcsc/Samsung-Electro-Mechanics-CL05C100JB5NNNC_C32949.pdf
D1 D2 = CMP-022-000007-2: Schottky Barrier Diode Common Cathode 30V 200mA; Manufacturer: LRC; ComponentLink1URL: https://datasheet.lcsc.com/lcsc/2006151233_LRC-S-LBAT54CLT1G_C559091.pdf; Source: Schottky Barrier Diodes.SchLib; ComponentLink1Description: Datasheet; LCSC Part Number: C559091; Design Item ID: LBAT54CLT1G
L1 L2 = CMP-032-000004-1: Inductor 220uH ±20% 0A65 470mR Wirewound Shielded; Manufacturer: TDK; Core: Ferrite; Saturation Current: 0A33; ComponentLink1URL: https://product.tdk.com/system/files/dam/doc/product/inductor/inductor/smd/catalog/inductor_commercial_power_slf7045_en.pdf; RoHS: Yes; ComponentLink1Description: Datasheet; Shielding: Shielded; LCSC Part Number: C24679; Min Operating Temperature: -40°C; Max Operating Temperature: 85°C
R23 R30 = CMP-010-000364-1: Resistor 680K 0603 ±1% Thick Film Uniroyal; Temperature Coefficient: ±100ppm/K; Working Voltage: 50V; Package: 0603; LCSC Part Number: C25822; Manufacturer: Uniroyal; ComponentLink1URL: https://datasheet.lcsc.com/szlcsc/1811062009_UNI-ROYAL-Uniroyal-Elec-0603WAF1002T5E_C25804.pdf; Temperature: -55 - 155°C; ComponentLink1Description: Datasheet; Pin Count: 2
R24 = CMP-010-000333-5: Resistor 390K 0603 ±1%Thick Film Uniroyal Elec; Package: 0603; Pin Count: 2; ComponentLink1Description: Datasheet; LCSC Part Number: C23150; Design Item ID: Res 390K 0603; Temperature: -55 - 155°C; Component Type: Standard; Source: Resistors.SchLib; ComponentLink1URL: https://datasheet.lcsc.com/szlcsc/1811062009_UNI-ROYAL-Uniroyal-Elec-0603WAF1002T5E_C25804.pdf
R25 = CMP-010-000365-1: Resistor 120K 0603 ±1% Thick Film Uniroyal; Temperature Coefficient: ±100ppm/K; Working Voltage: 50V; Package: 0603; Manufacturer: Uniroyal; Pin Count: 2; ComponentLink1URL: https://datasheet.lcsc.com/szlcsc/1811062009_UNI-ROYAL-Uniroyal-Elec-0603WAF1002T5E_C25804.pdf; LCSC Part Number: C25808; Temperature: -55 - 155°C; ComponentLink1Description: Datasheet
R26 R31 = CMP-010-000293-7: Resistor 10K 0603 ±1% Thick Film Uniroyal; Working Voltage: 50V; Temperature Coefficient: ±100ppm/K; Package: 0603; Pin Count: 2; Temperature: -55 - 155°C; Manufacturer: Uniroyal; ComponentLink1URL: https://datasheet.lcsc.com/szlcsc/1811062009_UNI-ROYAL-Uniroyal-Elec-0603WAF1002T5E_C25804.pdf; ComponentLink1Description: Datasheet; LCSC Part Number: C25804
R27 R32 = CMP-010-000287-8: Resistor 100K 0402 ±1% Thick Film Uniroyal; Temperature Coefficient: ±100ppm/K; Working Voltage: 50V; Package: 0402; Pin Count: 2; ComponentLink1Description: Datasheet; Temperature: -55 - 155°C; LCSC Part Number: C25741; Manufacturer: Uniroyal; ComponentLink1URL: https://datasheet.lcsc.com/szlcsc/1811062009_UNI-ROYAL-Uniroyal-Elec-0603WAF1002T5E_C25804.pdf
R28 = CMP-010-000332-8: Resistor 33K 0603 ±1% Thick Film Uniroyal; Working Voltage: 50V; Temperature Coefficient: ±100ppm/K; Package: 0603; LCSC Part Number: C4216; ComponentLink1Description: Datasheet; Pin Count: 2; Manufacturer: Uniroyal; ComponentLink1URL: https://datasheet.lcsc.com/szlcsc/1811062009_UNI-ROYAL-Uniroyal-Elec-0603WAF1002T5E_C25804.pdf; Temperature: -55 - 155°C
R29 = CMP-010-000363-2: Resistor 15K 0603 ±1% Thick Film Uniroyal; Temperature Coefficient: ±100ppm/K; Working Voltage: 50V; Package: 0603; ComponentLink1URL: https://datasheet.lcsc.com/szlcsc/1811062009_UNI-ROYAL-Uniroyal-Elec-0603WAF1002T5E_C25804.pdf; Manufacturer: Uniroyal; Temperature: -55 - 155°C; Pin Count: 2; ComponentLink1Description: Datasheet; LCSC Part Number: C22809
R33 = CMP-010-000366-1: Resistor 39K 0603 ±1% Thick Film Uniroyal; Temperature Coefficient: ±100ppm/K; Working Voltage: 50V; Package: 0603; ComponentLink1URL: https://datasheet.lcsc.com/szlcsc/1811062009_UNI-ROYAL-Uniroyal-Elec-0603WAF1002T5E_C25804.pdf; ComponentLink1Description: Datasheet; Pin Count: 2; Manufacturer: Uniroyal; Temperature: -55 - 155°C
R34 = CMP-010-000351-9: Resistor 12K 0603 ±1% Thick Film Uniroyal; Working Voltage: 50V; Temperature Coefficient: ±100ppm/K; Package: 0603; Manufacturer: Uniroyal; ComponentLink1URL: https://datasheet.lcsc.com/szlcsc/1811062009_UNI-ROYAL-Uniroyal-Elec-0603WAF1002T5E_C25804.pdf; Pin Count: 2; LCSC Part Number: C22790; ComponentLink1Description: Datasheet; Temperature: -55 - 155°C
U2 U5 = CMP-055-000003-2: DC-DC Conv 4V to 150V Synchronous Step Down Single-Out 0.8V to 150V 0.1A Automotive 12-Pin MSOP EP; Min Output Voltage: 800mV; Output Current: 100mA; LCSC Part Number: C117279; Min Input Voltage: 4V; ComponentLink1Description: Datasheet; RoHS: Yes; Package: SOP; Temperature: -40°C - 125°C; Max Output Voltage: 150V; ComponentLink1URL: https://www.analog.com/media/en/technical-documentation/data-sheets/3639fd.pdf
U3 U6 = CMP-008-000008-3: Adjustable LDO Voltage Regulator, 7 V to 100 V, 780 mV Drop, 1.161 V to 90 V / 50 mA out, MSOP-8; Reference Voltage: 1.185V; Max Input Voltage: 100V; Output Voltage: 90V; Max Output Current: 50mA; Quiescent Current: 20uA; Min Output Voltage: 1.2V; Max Power Dissipation: 833mW; Power: 1.83W; Min Input Voltage: 7V; Dropout Voltage: 780mV; LCSC Part Number: C55006; ComponentLink1URL: https://www.ti.com/lit/ds/symlink/tps7a4001.pdf?HQS=dis-dk-null-digikeymode-dsf-pf-null-wwe&ts=1626937665102&ref_url=https%253A%252F%252Fwww.digikey.de%252F; Package: MSOP; Max Output Voltage: 90V; RoHS: Yes; ComponentLink1Description: Datasheet; Output Current: 50mA; Temperature: -40°C - 125°C
U4 = CMP-008-000009-4: LDO Fixed 5V, 0.15A, 1% Accuracy, Max 16V Input, 65uA Iq, SOT-23-5; Manufacturer: Texas Instruments; Max Output Current: 150mA; Dropout Voltage: 280mV; Min Input Voltage: 2.2V; Max Supply Voltage: 16V; Max Operating Temperature: 125°C; RoHS: Yes; Accuracy: 1%; Min Operating Temperature: -40°C; LCSC Part Number: C109382; Output Voltage: 5V; ComponentLink1Description: Datasheet; Case/Package: SOT-23-5; Max Output Voltage: 5V; Quiescent Current: 65uA; ComponentLink1URL: https://www.ti.com/lit/ds/symlink/lp2985.pdf?ts=1627290889620&ref_url=https%253A%252F%252Fwww.google.com%252F; Max Input Voltage: 16V
U7 = CMP-008-000010-2: LDO Fixed 3V3, 0.15A, 1% Accuracy, Max 16V Input, 65uA Iq, SOT-23-5; Manufacturer: Texas Instruments; Min Input Voltage: 2.2V; Dropout Voltage: 280mV; Max Output Voltage: 5V; Output Voltage: 3.3V; Max Output Current: 150mA; Max Supply Voltage: 16V; Max Input Voltage: 16V; ComponentLink1Description: Datasheet; Min Operating Temperature: -40°C; Case/Package: SOT-23-5; ComponentLink1URL: https://www.ti.com/lit/ds/symlink/lp2985.pdf?ts=1627290889620&ref_url=https%253A%252F%252Fwww.google.com%252F; Accuracy: 1%; Max Operating Temperature: 125°C; Quiescent Current: 65uA; LCSC Part Number: C89826; RoHS: Yes